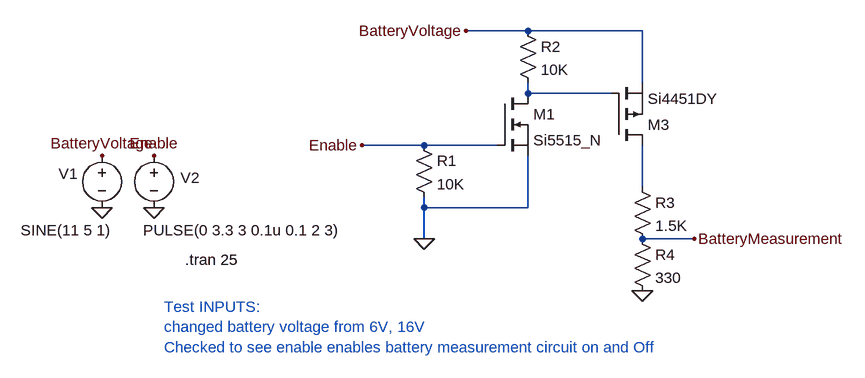
[diagram p0: schematic powerSupplyMeasurement.asc]
powerSupplyMeasurement.asc, the LTspice schematic file:
Version 4.1
SHEET 1 8692 680
WIRE 160 0 64 0
WIRE 336 0 160 0
WIRE 336 80 336 0
WIRE 160 96 160 80
WIRE 288 96 160 96
WIRE 0 176 -96 176
WIRE 112 176 0 176
WIRE 336 240 336 176
WIRE 0 272 0 256
WIRE 160 272 160 192
WIRE 160 272 0 272
WIRE 0 320 0 272
WIRE 416 320 336 320
FLAG 0 320 0
FLAG -416 272 0
FLAG -416 192 Enable
FLAG -496 272 0
FLAG -496 192 BatteryVoltage
FLAG -96 176 Enable
FLAG 64 0 BatteryVoltage
FLAG 416 320 BatteryMeasurement
FLAG 336 400 0
SYMBOL voltage -496 176 R0
WINDOW 0 -67 44 Left 2
WINDOW 3 -125 131 Left 2
WINDOW 123 0 0 Left 0
WINDOW 39 0 0 Left 0
SYMATTR InstName V1
SYMATTR Value SINE(11 5 1)
SYMBOL voltage -416 176 R0
WINDOW 0 41 50 Left 2
WINDOW 3 -17 131 Left 2
WINDOW 123 0 0 Left 0
WINDOW 39 0 0 Left 0
SYMATTR InstName V2
SYMATTR Value PULSE(0 3.3 3 0.1u 0.1 2 3)
SYMBOL res 144 -16 R0
SYMATTR InstName R2
SYMATTR Value 10K
SYMBOL nmos 112 96 R0
SYMATTR InstName M1
SYMATTR Value Si5515_N
SYMBOL pmos 288 176 M180
SYMATTR InstName M3
SYMATTR Value Si4451DY
SYMBOL res 320 224 R0
SYMATTR InstName R3
SYMATTR Value 1.5K
SYMBOL res -16 160 R0
SYMATTR InstName R1
SYMATTR Value 10K
SYMBOL res 320 304 R0
SYMATTR InstName R4
SYMATTR Value 330
TEXT -368 352 Left 2 !.tran 25
TEXT -400 424 Left 2 ;Test INPUTS:\nchanged battery voltage from 6V, 16V\nChecked to see enable enables battery measurement circuit on and Off

The netlist it stands for:
* powerSupplyMeasurement.asc
V1 BatteryVoltage 0 SINE(11 5 1)
V2 Enable 0 PULSE(0 3.3 3 0.1u 0.1 2 3)
R2 BatteryVoltage N001 10K
M1 N001 Enable 0 0 Si5515_N
M3 N002 N001 BatteryVoltage BatteryVoltage Si4451DY
R3 N002 BatteryMeasurement 1.5K
R1 Enable 0 10K
R4 BatteryMeasurement 0 330
.model NMOS NMOS
.model PMOS PMOS
.lib standard.mos
.tran 25
* Test INPUTS:
* changed battery voltage from 6V, 16V
* Checked to see enable enables battery measurement circuit on and Off
.backanno
.end